# EAGLE design fb3.32_2x4_02_neueGS (EAGLE 5.00)
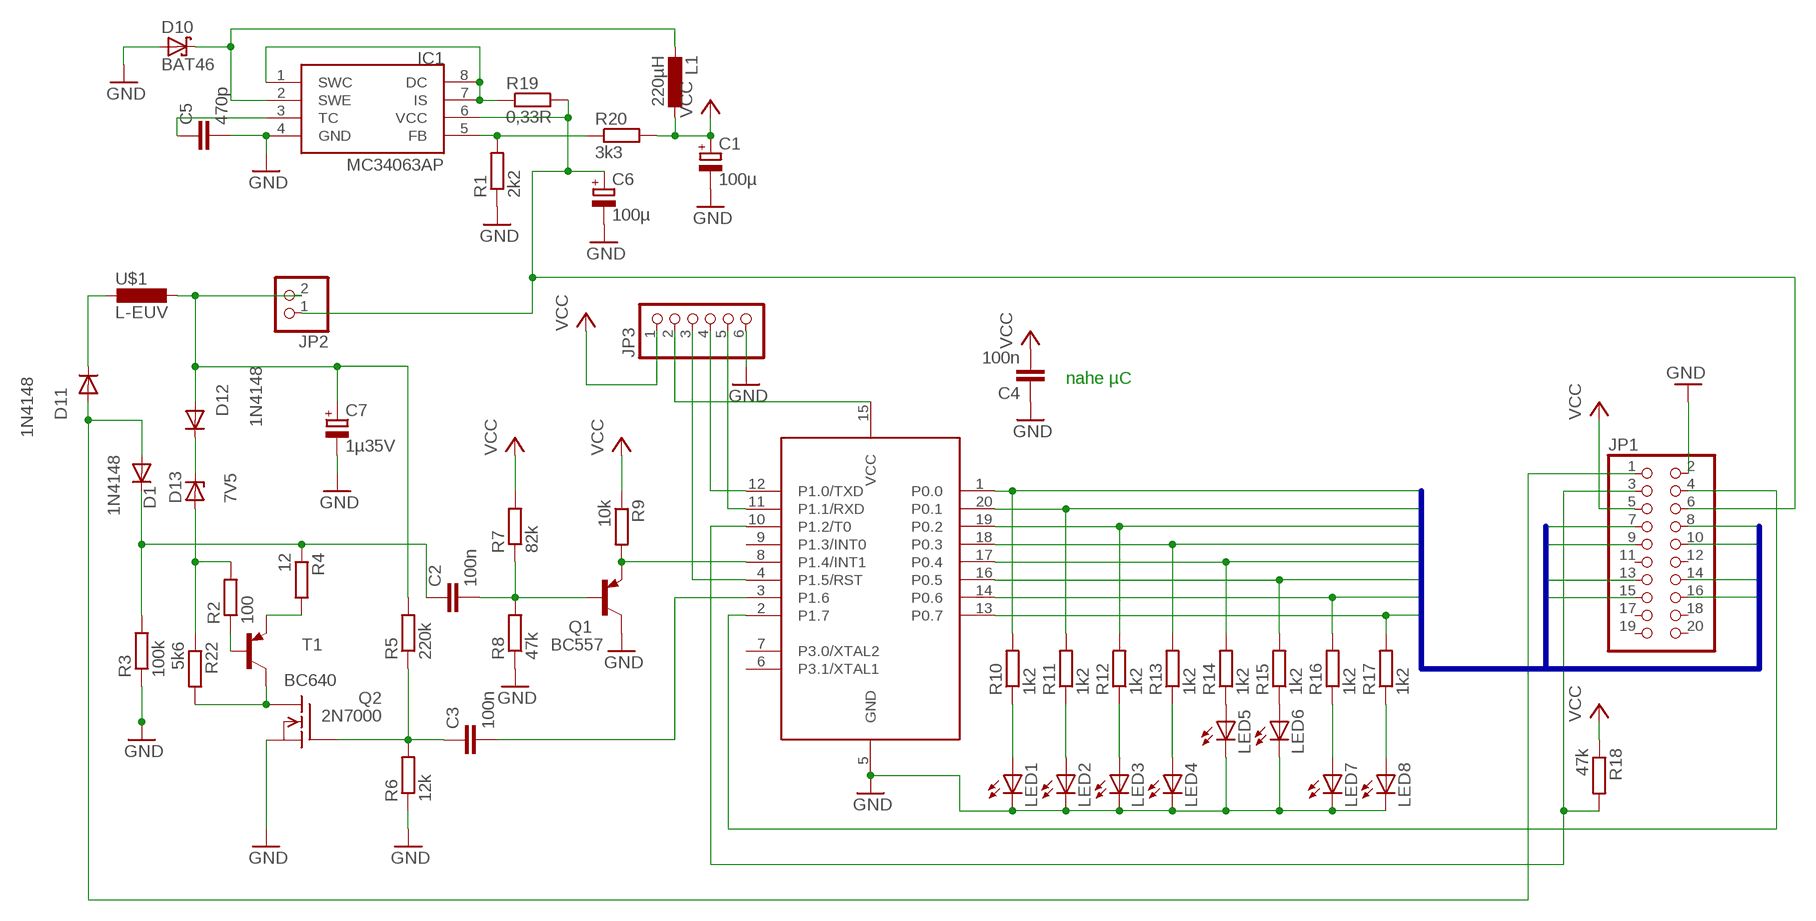
[diagram p0: schematic, sheet 1]

## Parts
C1  100µ  CPOL-EUE5-8.5  [E5-8,5]
C2  100n  C-EU050-024X044  [C050-024X044]
C3  100n  C-EU050-024X044  [C050-024X044]
C4  100n  C-EU050-024X044  [C050-024X044]
C5  470p  C-EU025-024X044  [C025-024X044]
C6  100µ  CPOL-EUE5-8.5  [E5-8,5]
C7  1µ35V  CPOL-EUE2.5-7  [E2,5-7]
D1  1N4148  [DO35-10]
D10  BAT46  BAT49  [DO41-10]
D11  1N4148  [DO35-10]
D12  1N4148  [DO35-10]
D13  7V5  ZPD  [DO35Z10]
IC1  MC34063AP  [DIL08]
JP1  PINHD-2X10  [2X10]
JP2  PINHD-1X2  [1X02]
JP3  PINHD-1X6  [1X06]
L1  220µH  L-EU2200-12.7  [2200-12.7]
LED1  LED3MM  [LED3MM]
LED2  LED3MM  [LED3MM]
LED3  LED3MM  [LED3MM]
LED4  LED3MM  [LED3MM]
LED5  LED3MM  [LED3MM]
LED6  LED3MM  [LED3MM]
LED7  LED3MM  [LED3MM]
LED8  LED3MM  [LED3MM]
Q1  BC557  [TO92]
Q2  2N7000  VN2222KM  [TO237]
R1  2k2  R-EU_0207/10  [0207/10]
R2  100  R-EU_0207/2V  [0207/2V]
R3  100k  R-EU_0207/10  [0207/10]
R4  12  R-EU_0207/10  [0207/10]
R5  220k  R-EU_0207/10  [0207/10]
R6  12k  R-EU_0207/10  [0207/10]
R7  82k  R-EU_0207/10  [0207/10]
R8  47k  R-EU_0207/10  [0207/10]
R9  10k  R-EU_0207/2V  [0207/2V]
R10  1k2  R-EU_0207/10  [0207/10]
R11  1k2  R-EU_0207/10  [0207/10]
R12  1k2  R-EU_0207/10  [0207/10]
R13  1k2  R-EU_0207/10  [0207/10]
R14  1k2  R-EU_0207/10  [0207/10]
R15  1k2  R-EU_0207/5V  [0207/5V]
R16  1k2  R-EU_0207/10  [0207/10]
R17  1k2  R-EU_0207/10  [0207/10]
R18  47k  R-EU_0207/10  [0207/10]
R19  0,33R  R-EU_0207/10  [0207/10]
R20  3k3  R-EU_0207/10  [0207/10]
R22  5k6  R-EU_0207/5V  [0207/5V]
T1  BC640  BC640-PNP-TO92-BCE  [TO92-BCE]
U1  89LPC922  [DIL20]
U$1  L-EUV  [11P]

## Nets
BASIC_RECIVE: C2.2 Q1.2(B) R7.1 R8.2
EIB+: D1.A D11.A JP1.1
FET_GATE: C3.1 Q2.2(G) R5.1 R6.2
FREQ: C5.1 IC1.3(TC)
GND: C1.- C4.1 C5.2 C6.- C7.- D10.A IC1.4(GND) JP1.2 JP3.6 LED1.K(C) LED2.K(C) LED3.K(C) LED4.K(C) LED5.K(C) LED6.K(C) LED7.K(C) LED8.K(C) Q1.3(C) Q2.3(S) R1.1 R3.1 R6.1 R8.1 U1.5(GND)
I_SENSED: IC1.1(SWC) IC1.7(IS) IC1.8(DC) R19.1
INDUCTOR: D10.C IC1.2(SWE) L1.2
LPC_RECIVE: Q1.1(E) R9.2 U1.8(P1.4/INT1)
LPC_SEND: C3.2 U1.3(P1.6)
N$1: D11.C U$1.P$2
N$2: C7.+ D12.A JP2.2 R5.2 U$1.P$1
N$3: C2.1 D1.C R3.2 R4.1
N$4: R4.2 T1.E
N$6: Q2.1(D) R22.2 T1.C
N$7: IC1.5(FB) R1.2 R20.1
N$8: R2.1 T1.B
N$15: LED1.A R10.1
N$16: D12.C D13.C
N$18: D13.A R2.2 R22.1
N$20: LED2.A R11.1
N$21: LED3.A R12.1
N$22: LED4.A R13.1
N$25: LED7.A R16.1
N$26: LED8.A R17.1
N$27: LED5.A R14.1
N$29: JP3.4 U1.12(P1.0/TXD)
N$30: JP3.5 U1.11(P1.1/RXD)
N$31: JP3.3 U1.4(P1.5/RST)
N$35: LED6.A R15.1
P0.0: JP1.7 R10.2 U1.1(P0.0)
P0.1: JP1.8 R11.2 U1.20(P0.1)
P0.2: JP1.9 R12.2 U1.19(P0.2)
P0.3: JP1.10 R13.2 U1.18(P0.3)
P0.4: JP1.13 R14.2 U1.17(P0.4)
P0.5: JP1.14 R15.2 U1.16(P0.5)
P0.6: JP1.15 R16.2 U1.14(P0.6)
P0.7: JP1.16 R17.2 U1.13(P0.7)
PROG: JP1.4 U1.2(P1.7)
PWM_LPC: JP1.3 R18.2 U1.10(P1.2/T0)
VCC: C1.+ C4.2 JP1.5 JP3.1 L1.1 R7.2 R9.1 R18.1 R20.2
VCC_LPC: JP3.2 U1.15(VCC)
VERSORGUNG: C6.+ IC1.6(VCC) JP1.6 JP2.1 R19.2
Unconnected: JP1.11 JP1.12 JP1.17 JP1.18 JP1.19 JP1.20 U1.6(P3.1/XTAL1) U1.7(P3.0/XTAL2) U1.9(P1.3/INT0)

## Buses
P0.[0..7]

## Notes on the sheet
- nahe µC

## Library data of the parts
C1 C6 C7 = rcl:CPOL-EU: POLARIZED CAPACITOR, European symbol
C2-C5 = rcl:C-EU: CAPACITOR, European symbol
D1 D11 D12 = diode:1N4148: DIODE high speed (Philips)
D10 = diode:BAT49: DIODE small signal diode
D13 = diode:ZPD: Z DIODE 500 mW
IC1 = mc34063:MC34063
JP1 = pinhead:PINHD-2X10: PIN HEADER
JP2 = pinhead:PINHD-1X2: PIN HEADER
JP3 = pinhead:PINHD-1X6: PIN HEADER
L1 = rcl:L-EU: INDUCTOR, European symbol
LED1-LED8 = led:LED: LED OSRAM: - CHIPLED LG R971, LG N971, LY N971, LG Q971, LY Q971, LO R971, LY R971 LH N974, LH R974 LS Q976, LO Q976, LY Q976 LO Q996 - Hyper CHIPLED LW Q18S LB Q993, LB Q99A, LB R99A - SideLED LS A670, LO A670, LY A670, LG A670, LP A670 LB A673, LV A673, LT A673, LW A673 LH A674 LY A675 LS A676, LA A676, LO A676, LY A676, LW A676 LS A679, LY A679, LG A679 - Hyper Micro SIDELED® LS Y876, LA Y876, LO Y876, LY Y876 LT Y87S - SmartLED LW L88C, LW L88S LB L89C, LB L89S, LG L890 LS L89K, LO L89K, LY L89K LS L896, LA L896, LO L896, LY L896 - TOPLED LS T670, LO T670, LY T670, LG T670, LP T670 LSG T670, LSP T670, LSY T670, LOP T670, LYG T670 LG T671, LOG T671, LSG T671 LB T673, LV T673, LT T673, LW T673 LH T674 LS T676, LA T676, LO T676, LY T676, LB T676, LH T676, LSB T676, LW T676 LB T67C, LV T67C, LT T67C, LS T67K, LO T67K, LY T67K, LW E67C LS E67B, LA E67B, LO E67B, LY E67B, LB E67C, LV E67C, LT E67C LW T67C LS T679, LY T679, LG T679 LS T770, LO T770, LY T770, LG T770, LP T770 LB T773, LV T773, LT T773, LW T773 LH T774 LS E675, LA E675, LY E675, LS T675 LS T776, LA T776, LO T776, LY T776, LB T776 LHGB T686 LT T68C, LB T68C - Hyper Mini TOPLED® LB M676 - Mini TOPLED Santana® LG M470 LS M47K, LO M47K, LY M47K Source: http://www.osram.convergy.de - LUMILED® LXK2-PW12-R00, LXK2-PW12-S00, LXK2-PW14-U00, LXK2-PW14-V00 LXK2-PM12-R00, LXK2-PM12-S00, LXK2-PM14-U00 LXK2-PE12-Q00, LXK2-PE12-R00, LXK2-PE12-S00, LXK2-PE14-T00, LXK2-PE14-U00 LXK2-PB12-K00, LXK2-PB12-L00, LXK2-PB12-M00, LXK2-PB14-N00, LXK2-PB14-P00, LXK2-PB14-Q00 LXK2-PR12-L00, LXK2-PR12-M00, LXK2-PR14-Q00, LXK2-PR14-R00 LXK2-PD12-Q00, LXK2-PD12-R00, LXK2-PD12-S00 LXK2-PH12-R00, LXK2-PH12-S00 LXK2-PL12-P00, LXK2-PL12-Q00, LXK2-PL12-R00 Source: www.luxeon.com
Q1 = transistor-pnp:BC557: PNP Transistor
Q2 = transistor-fet:VN2222KM: N-Channel Enhancement MOSFET (VMOS); 60V; 0,5A; 7,5Ohm
R1-R20 R22 = rcl:R-EU_: RESISTOR, European symbol
T1 = transistor:*-PNP-: PNP Transistror
U1 = micro-philips:89LPC922
U$1 = rcl:L-EUV

## Board
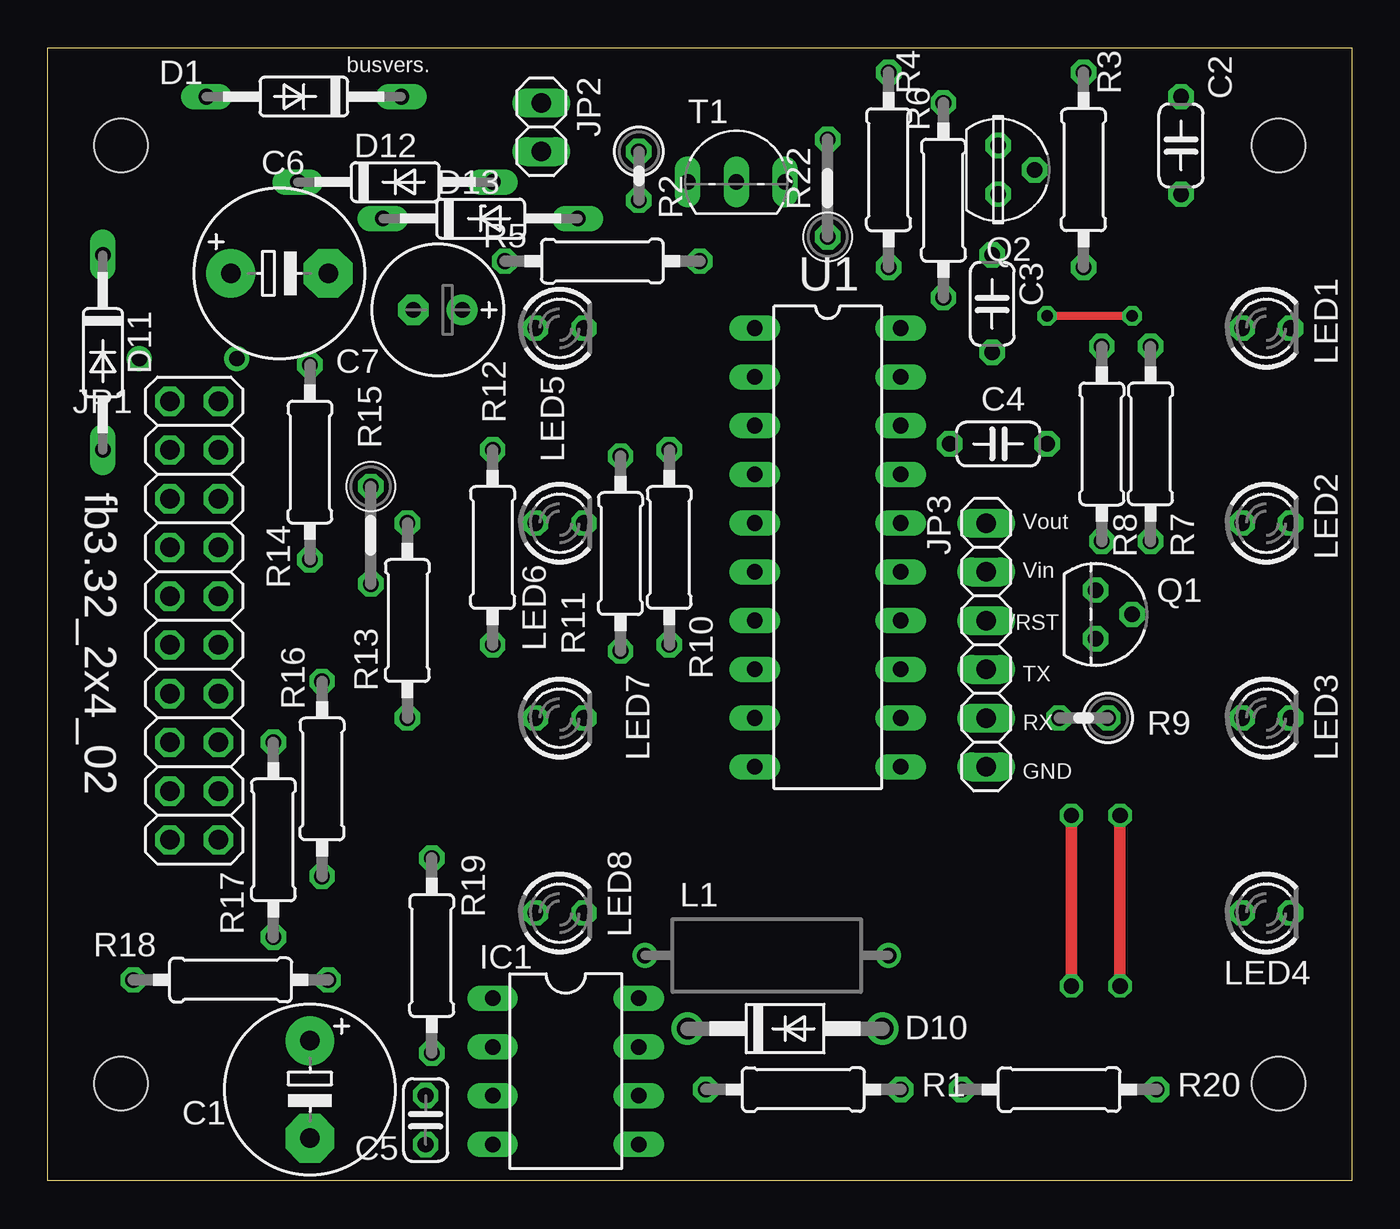
[diagram p1: board, top side]
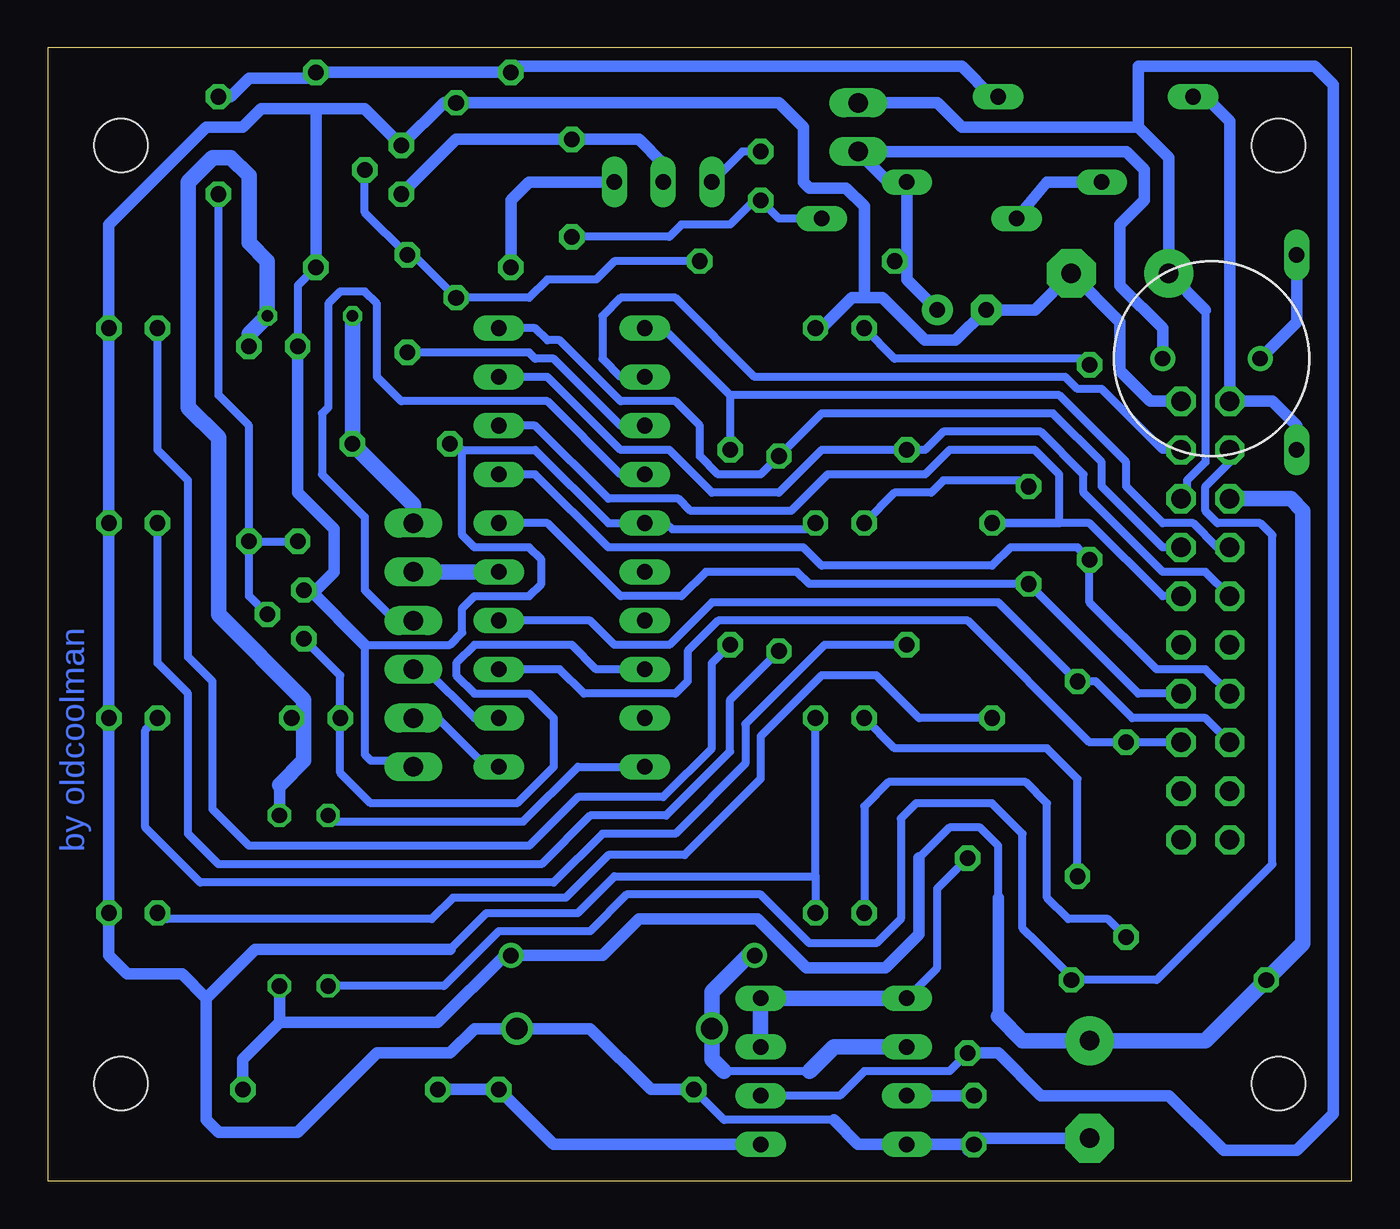
[diagram p2: board, bottom side, seen from below]

Size 67.94 x 59.05 mm. Coordinates in mm from the lower left corner, seen from the top.
Outline: 0,0 0,59.05 67.94,59.05 67.94,0 0,0
Copper layers (1*16): Top 0.035mm / dielectric 1.5mm / Bottom 0.035mm
Design rules "default": minimum track width 10mil, minimum drill 24mil, track to track 12mil, track to pad 12mil, pad to pad 12mil, via to via 12mil, smd to smd 8mil, copper to edge 20mil, drill to drill 8mil, minimum pad ring 10mil, minimum via ring 8mil, stop-mask expansion 4mil, vias tented up to drill 0mil, thermal gap 10mil
Holes 2.8 mm at 3.81,53.98 64.14,53.98 64.14,5.08 3.81,5.08

### Footprints (pad centres in the part's own frame; a part is rotated, then mirrored left to right if it is on the bottom)
E5-8,5 = drill 1.016 pad 2.54 round: + -2.54,0 | drill 1.016 pad 2.54 octagon: - 2.54,0
C050-024X044 = drill 0.813 octagon: 1 -2.54,0; 2 2.54,0
C025-024X044 = drill 0.813 octagon: 1 -1.27,0; 2 1.27,0
E2,5-7 = drill 0.813 pad 1.6 round: + -1.27,0 | drill 0.813 pad 1.6 octagon: - 1.27,0
DO35-10 = drill 0.813 long: A 5.08,0; C -5.08,0
DO41-10 = drill 1.118 round: A 5.08,0; C -5.08,0
DO35Z10 = drill 0.813 long: A 5.08,0; C -5.08,0
DIL08 = drill 0.813 long: 1 -3.81,-3.81; 2 -1.27,-3.81; 3 1.27,-3.81; 4 3.81,-3.81; 5 3.81,3.81; 6 1.27,3.81; 7 -1.27,3.81; 8 -3.81,3.81
2X10 = drill 1.016 octagon: 1 -11.43,-1.27; 2 -11.43,1.27; 3 -8.89,-1.27; 4 -8.89,1.27; 5 -6.35,-1.27; 6 -6.35,1.27; 7 -3.81,-1.27; 8 -3.81,1.27; 9 -1.27,-1.27; 10 -1.27,1.27; 11 1.27,-1.27; 12 1.27,1.27; 13 3.81,-1.27; 14 3.81,1.27; 15 6.35,-1.27; 16 6.35,1.27; 17 8.89,-1.27; 18 8.89,1.27; 19 11.43,-1.27; 20 11.43,1.27
1X02 = drill 1.016 long: 1 -1.27,0; 2 1.27,0
1X06 = drill 1.016 long: 1 -6.35,0; 2 -3.81,0; 3 -1.27,0; 4 1.27,0; 5 3.81,0; 6 6.35,0
2200-12.7 = drill 0.8 pad 1.27 round: 1 -6.35,0; 2 6.35,0
LED3MM = drill 0.813 octagon: A -1.27,0; K 1.27,0
TO92 = drill 0.813 octagon: 1 1.27,0; 2 0,1.905; 3 -1.27,0
TO237 = drill 0.813 octagon: 1 1.27,0; 2 0,1.905; 3 -1.27,0
0207/10 = drill 0.813 octagon: 1 -5.08,0; 2 5.08,0
0207/2V = drill 0.813 octagon: 1 -1.27,0; 2 1.27,0
0207/5V = drill 0.813 octagon: 1 -2.54,0; 2 2.54,0
TO92-BCE = drill 0.813 long: B -2.54,0; C 0,0; E 2.54,0
DIL20 = drill 0.813 long: 1 -11.43,-3.81; 2 -8.89,-3.81; 3 -6.35,-3.81; 4 -3.81,-3.81; 5 -1.27,-3.81; 6 1.27,-3.81; 7 3.81,-3.81; 8 6.35,-3.81; 9 8.89,-3.81; 10 11.43,-3.81; 11 11.43,3.81; 12 8.89,3.81; 13 6.35,3.81; 14 3.81,3.81; 15 1.27,3.81; 16 -1.27,3.81; 17 -3.81,3.81; 18 -6.35,3.81; 19 -8.89,3.81; 20 -11.43,3.81
11P = drill 0.8 round: P$1 -2.54,0; P$2 2.54,0

### Placement (x,y rotation side)
C1  13.65,4.76 270 top
C2  59.05,53.98 270 top
C3  49.21,45.72 270 top
C4  49.53,38.42 0 top
C5  19.68,3.17 270 top
C6  12.06,47.31 0 top
C7  20.32,45.4 180 top
D1  13.34,56.52 180 top
D10  38.42,7.94 0 top
D11  2.86,43.18 270 top
D12  18.1,52.07 0 top
D13  22.54,50.16 0 top
IC1  26.99,5.71 270 top
JP1  7.62,29.21 270 top
JP2  25.72,54.93 270 top
JP3  48.9,27.94 270 top
L1  37.47,11.75 180 top
LED1  63.5,44.45 0 top
LED2  63.5,34.29 0 top
LED3  63.5,24.13 0 top
LED4  63.5,13.97 0 top
LED5  26.67,44.45 0 top
LED6  26.67,34.29 0 top
LED7  26.67,24.13 0 top
LED8  26.67,13.97 0 top
Q1  54.61,29.53 270 top
Q2  49.53,52.7 270 top
R1  39.37,4.76 0 top
R2  30.8,52.39 270 top
R3  53.98,52.7 90 top
R4  43.81,52.7 270 top
R5  28.89,47.94 180 top
R6  46.67,51.12 270 top
R7  57.47,38.42 90 top
R8  54.93,38.42 270 top
R9  53.98,24.13 180 top
R10  32.38,33.02 90 top
R11  29.84,32.7 90 top
R12  23.18,33.02 90 top
R13  18.73,29.21 90 top
R14  13.65,37.47 270 top
R15  16.83,33.66 270 top
R16  14.29,20.95 90 top
R17  11.75,17.78 90 top
R18  9.53,10.48 0 top
R19  20,11.75 270 top
R20  52.7,4.76 0 top
R22  40.64,51.75 90 top
T1  35.88,52.07 0 top
U1  40.64,33.02 270 top
U$1  7.3,42.86 0 bottom

### Tracks (layer width: path | path; a pad name or v marks a point on that pad's centre or on a via)
BASIC_RECIVE
  Bottom 0.406: R7.1 R8.2 R7.1 | Q1.2 57.47,30.48 R7.1 | R7.1 57.47,39.37 59.05,40.96 C2.2
EIB+
  Bottom 0.61: D1.A 7.62,56.52 6.35,55.24 JP1.1 4.13,40.64 2.86,39.37 D11.A
FET_GATE
  Bottom 0.406: Q2.2 51.44,50.48 C3.1 48.9,48.26 R6.2 42.86,46.04 41.91,46.99 39.37,46.99 38.42,47.94 R5.1
FREQ
  Bottom 0.61: C5.1 IC1.3
GND
  Bottom 0.406: 46.35,38.1 42.55,38.1 38.73,34.29 U1.5 35.72,34.29 35.4,33.97 28.26,33.97 LED6.K | 46.35,38.1 46.35,33.66 45.72,33.02 42.86,33.02 42.23,32.38 42.23,31.11 42.86,30.48 45.72,30.48 46.35,29.84 46.35,28.57 46.99,27.94 51.44,27.94 51.44,22.23 51.12,21.91 49.21,21.91 JP3.6 | 54.29,30.8 Q1.3 53.98,30.8 | 26.99,3.17 32.7,3.17 R1.1 | 20,1.59 C5.2 | 27.94,15.88 LED8.K | 27.94,15.88 38.42,15.88 40.32,13.97 45.09,13.97 46.99,12.06 | 27.94,15.88 LED7.K | R3.1 54.93,46.67 54.93,46.35 R8.1 | 47.31,56.2 R6.1 | 46.35,38.1 46.67,38.1 C4.1
  Bottom 0.61: 54.29,30.8 51.44,27.94 | R8.1 54.93,35.88 53.02,33.97 53.02,31.75 53.98,30.8 | LED3.K LED2.K LED1.K 64.77,49.85 59.69,54.93 57.78,54.93 56.83,55.88 53.98,55.88 | C5.2 IC1.4 25.72,1.91 26.99,3.17 | R1.1 36.51,4.76 39.69,7.94 D10.A 45.72,7.94 46.99,6.67 50.8,6.67 54.93,2.54 59.05,2.54 59.69,3.17 59.69,9.53 | C1.- 19.37,2.22 20,1.59 | JP1.2 10.48,40.64 12.06,42.23 12.06,44.77 C6.- 16.51,45.4 C7.- 20.64,43.81 22.23,43.81 24.45,46.04 25.4,46.04 | LED3.K 64.93,24.13 | 46.99,12.06 57.15,12.06 59.69,9.53 | 25.4,46.04 26.04,46.04 27.62,44.45 LED5.K | LED3.K LED4.K 64.77,11.75 63.82,10.79 60.96,10.79 59.69,9.53 | 47.31,56.2 Q2.3 51.44,55.88 53.98,55.88 | 53.98,55.88 R3.1 | 25.4,46.04 25.4,50.8 26.35,51.75 28.26,51.75 28.57,52.07 28.57,54.93 29.84,56.2 R6.1
I_SENSED
  Bottom 0.406: R19.1 21.59,15.24 21.59,11.11 IC1.1
  Bottom 0.813: IC1.7 IC1.8 IC1.1
INDUCTOR
  Bottom 0.406: 31.43,11.75 L1.2 | 28.26,5.71 32.7,5.71
  Bottom 0.813: 31.43,11.75 33.34,9.84 D10.C 33.34,6.35 32.7,5.71 | IC1.2 26.99,6.99 28.26,5.71
LPC_RECIVE
  Bottom 0.406: U1.8 39.37,26.67 40.64,27.94 45.72,27.94 46.67,26.99 46.67,26.35 45.72,25.4 42.86,25.4 41.59,24.13 41.59,21.59 43.5,19.68 51.12,19.68 52.7,21.27 R9.2 52.7,26.35 Q1.1
LPC_SEND
  Bottom 0.406: U1.3 38.1,39.37 41.59,42.86 42.55,42.86 42.86,43.18 C3.2
N$1
  Bottom 0.61: D11.C 2.86,44.77 U$1.P$2
N$2
  Bottom 0.406: JP2.2 26.99,53.66
  Bottom 0.61: U$1.P$1 9.84,44.45 12.06,46.67 12.06,49.85 10.79,51.12 10.79,52.7 11.75,53.66 JP2.2 24.13,52.07 D12.A 23.18,47.94 | C7.+ 23.18,46.99 23.18,47.94 | 23.18,47.94 R5.2
N$3
  Bottom 0.406: D1.C 18.73,56.52 | 43.5,58.1 R4.1 | R3.2 54.29,57.78
  Bottom 0.61: C2.1 58.42,56.52 57.47,57.47 54.29,57.47 R3.2 R4.1 | 18.73,56.52 20.32,58.1 39.05,58.1 43.5,58.1
N$4
  Bottom 0.61: T1.E 42.86,52.07 43.81,51.12 R4.2
N$5  (via drill 0.6)
  other vias: 3.81,53.98
N$6
  Bottom 0.61: Q2.1 46.67,54.29 R22.2 37.15,54.29 35.88,53.02 T1.C
N$7
  Bottom 0.61: IC1.5 41.59,1.91 R1.2 R20.1
N$8
  Bottom 0.406: R2.1 31.75,53.66 T1.B
N$9  (via drill 0.6)
  other vias: 3.81,5.08
N$11  (via drill 0.6)
  other vias: 64.14,53.98
N$12  (via drill 0.6)
  other vias: 64.14,5.08
N$15
  Bottom 0.406: LED1.A 62.23,38.1 60.64,36.51 60.64,27.3 59.37,26.04 59.37,19.37 57.47,17.46 42.86,17.46 40.32,20 35.88,20 33.34,22.54 33.34,26.99 R10.1
N$16
  Bottom 0.61: D12.C 15.88,52.07 D13.C
N$18
  Bottom 0.406: D13.A 29.84,50.16 R2.2 31.11,51.12 32.38,49.85 34.92,49.85 35.56,49.21 R22.1
N$20
  Bottom 0.406: LED2.A 62.23,26.99 60.64,25.4 60.64,18.1 59.05,16.51 42.23,16.51 39.69,19.05 35.72,19.05 32.38,22.38 32.38,25.08 R11.1
N$21
  Bottom 0.406: LED3.A 62.87,23.5 62.87,18.41 60.01,15.56 41.59,15.56 39.05,18.1 35.24,18.1 31.59,21.75 31.59,23.81 27.46,27.94 R12.1
N$22
  Bottom 0.406: 30.8,23.18 30.8,20.95 34.77,16.99 38.73,16.99 40.96,14.76 46.83,14.76 47.94,13.65 61.75,13.65 LED4.A | R13.1 22.54,24.13 24.77,26.35 27.62,26.35 30.8,23.18 | 30.8,23.18
N$25
  Bottom 0.406: LED7.A 23.81,22.54 15.88,22.54 14.29,20.95 R16.1
N$26
  Bottom 0.406: R17.1 12.7,13.65 14.76,13.65 15.88,14.76 15.88,19.68 16.99,20.8 24.13,20.8 25.4,19.53 LED8.A
N$27
  Bottom 0.406: R14.1 13.97,42.86 23.81,42.86 LED5.A
N$29
  Bottom 0.406: U1.12 45.72,24.13 48.26,26.67 JP3.4
N$30
  Bottom 0.406: U1.11 45.09,21.59 47.62,24.13 JP3.5
N$31
  Bottom 0.406: U1.4 38.1,36.83 41.91,40.64 49.53,40.64 50.8,41.91 50.8,45.72 51.44,46.35 52.7,46.35 53.34,45.72 53.34,40.32 53.66,40.01 53.66,36.83 51.44,34.61 51.44,30.8 49.85,29.21 JP3.3
N$35
  Bottom 0.406: R15.1 17.14,36.51 21.27,36.51 21.91,35.88 23.81,35.88 LED6.A
P0.0
  Bottom 0.406: JP1.7 6.99,33.02 8.26,34.29 9.84,34.29 11.75,36.2 11.75,37.47 15.24,40.96 32.38,40.96 | U1.1 35.88,44.45 32.38,40.96 | 32.38,40.96 R10.2
P0.1
  Bottom 0.406: JP1.8 9.84,33.02 13.02,36.2 13.02,37.47 15.56,40.01 27.62,40.01 R11.2 30.8,36.83 33.02,36.83 33.97,37.78 33.97,39.37 35.24,40.64 38.1,40.64 41.27,43.81 41.91,43.81 42.55,44.45 U1.20
P0.2
  Bottom 0.406: JP1.9 7.62,31.75 9.84,31.75 13.97,35.88 13.97,36.83 16.19,39.05 21.27,39.05 22.23,38.1 R12.2 27.62,38.1 29.84,35.88 33.34,35.88 35.56,38.1 38.1,38.1 41.91,41.91 U1.19
P0.3
  Bottom 0.406: JP1.10 9.84,30.48 13.65,34.29 R13.2 15.24,34.29 15.24,36.83 16.51,38.1 20.95,38.1 22.23,36.83 27.3,36.83 29.21,34.92 34.45,34.92 35.08,35.56 38.73,35.56 42.55,39.37 U1.18
P0.4
  Bottom 0.406: JP1.13 7.62,26.67 10.16,26.67 13.65,30.16 R14.2 14.29,33.02 17.78,33.02 18.73,32.07 27.62,32.07 28.57,33.02 38.73,33.02 42.55,36.83 U1.17
P0.5
  Bottom 0.406: JP1.14 11.11,25.4 R15.2 28.26,31.11 28.89,31.75 33.66,31.75 34.92,30.48 38.1,30.48 41.91,34.29 U1.16
P0.6
  Bottom 0.406: JP1.15 7.62,24.13 11.43,24.13 13.34,26.04 R16.2 18.41,30.16 33.34,30.16 35.56,27.94 38.42,27.94 39.69,29.21 U1.14
P0.7
  Bottom 0.406: JP1.16 R17.2 13.65,22.86 20,29.21 33.02,29.21 34.61,27.62 34.61,26.04 35.24,25.4 40.01,25.4 41.27,26.67 U1.13
PROG
  Bottom 0.406: JP1.4 9.84,38.1 13.02,41.27 14.29,41.27 14.92,41.91 31.11,41.91 35.24,46.04 38.1,46.04 39.05,45.09 39.05,42.86 38.1,41.91 U1.2
PWM_LPC  (via drill 0.8)
  Top 0.61: v53.34,10.16 v53.34,19.05
  Bottom 0.406: JP1.3 6.35,37.47 7.62,36.2 7.62,34.92 6.99,34.29 4.76,34.29 4.13,33.66 4.13,16.51 10.16,10.48 R18.2 14.45,10.48 16.35,12.38 17.14,13.18 17.14,18.1 18.73,19.68 22.7,19.68 23.5,18.89 23.5,13.65 24.77,12.38 28.26,12.38 30.8,14.92 37.78,14.92 39.69,13.02 44.45,13.02 47.31,10.16 v53.34,10.16 | U1.10 40.32,21.59 43.18,18.73 53.02,18.73 arc90 v53.34,19.05
VCC  (via drill 0.6, 0.8)
  Top 0.406: v56.52,45.09 v52.07,45.09
  Top 0.61: v55.88,10.16 v55.88,19.05
  Bottom 0.406: R9.1 54.61,24.13 54.61,25.08 | 18.41,14.76 18.41,17.46 19.37,18.41 20.95,18.41 22.54,16.83
  Bottom 0.61: 18.41,8.57 18.41,14.76 | 22.54,16.83 22.54,12.86 24.29,11.11 28.42,11.11 30.96,13.65 37.15,13.65 39.05,11.75 L1.1 44.13,11.75 47.62,8.26 55.88,8.26 | 55.88,8.26 v55.88,10.16 | v55.88,19.05 55.88,20.64 | R20.2 57.78,6.35 55.88,8.26
  Bottom 0.813: JP1.5 3.17,35.56 2.54,34.92 2.54,12.38 R18.1 7.62,7.3 C1.+ 17.14,7.3 18.41,8.57 | 55.88,20.64 54.61,21.91 54.61,25.08 59.05,29.53 59.05,38.73 60.64,40.32 60.64,52.07 59.37,53.34 58.42,53.34 57.47,52.39 57.47,48.9 56.52,47.94 v56.52,45.09 57.47,44.13 57.47,43.81 R7.2 | JP3.1 48.9,35.24 C4.2 v52.07,45.09
VCC_LPC
  Bottom 0.813: U1.15 JP3.2
VERSORGUNG
  Bottom 0.406: JP1.6 8.89,35.88 8.57,36.2 8.57,36.51 7.62,37.47 7.62,45.4 | IC1.6 26.67,4.45 25.4,5.71 20.95,5.71 R19.2
  Bottom 0.61: R19.2 18.41,6.67 16.19,4.45 9.53,4.45 6.67,1.59 2.86,1.59 0.95,3.49 0.95,57.15 1.91,58.1 11.11,58.1 11.11,54.93 | 11.11,54.93 9.53,53.34 C6.+ 7.62,45.4 | JP2.1 21.59,56.2 20.32,54.93 11.11,54.93

### Text on the board
Bottom: by oldcoolman
tPlace: busvers. | fb3.32_2x4_02 | Vout | Vin | /RST | TX | RX | GND